# Altium schematic sheet LEO_COTS_ant_tripler_rev1.SchDoc: COTS LEO TX
size A; DocumentNumber: 1; Revision: 1; SheetNumber: 1; SheetTotal: 1
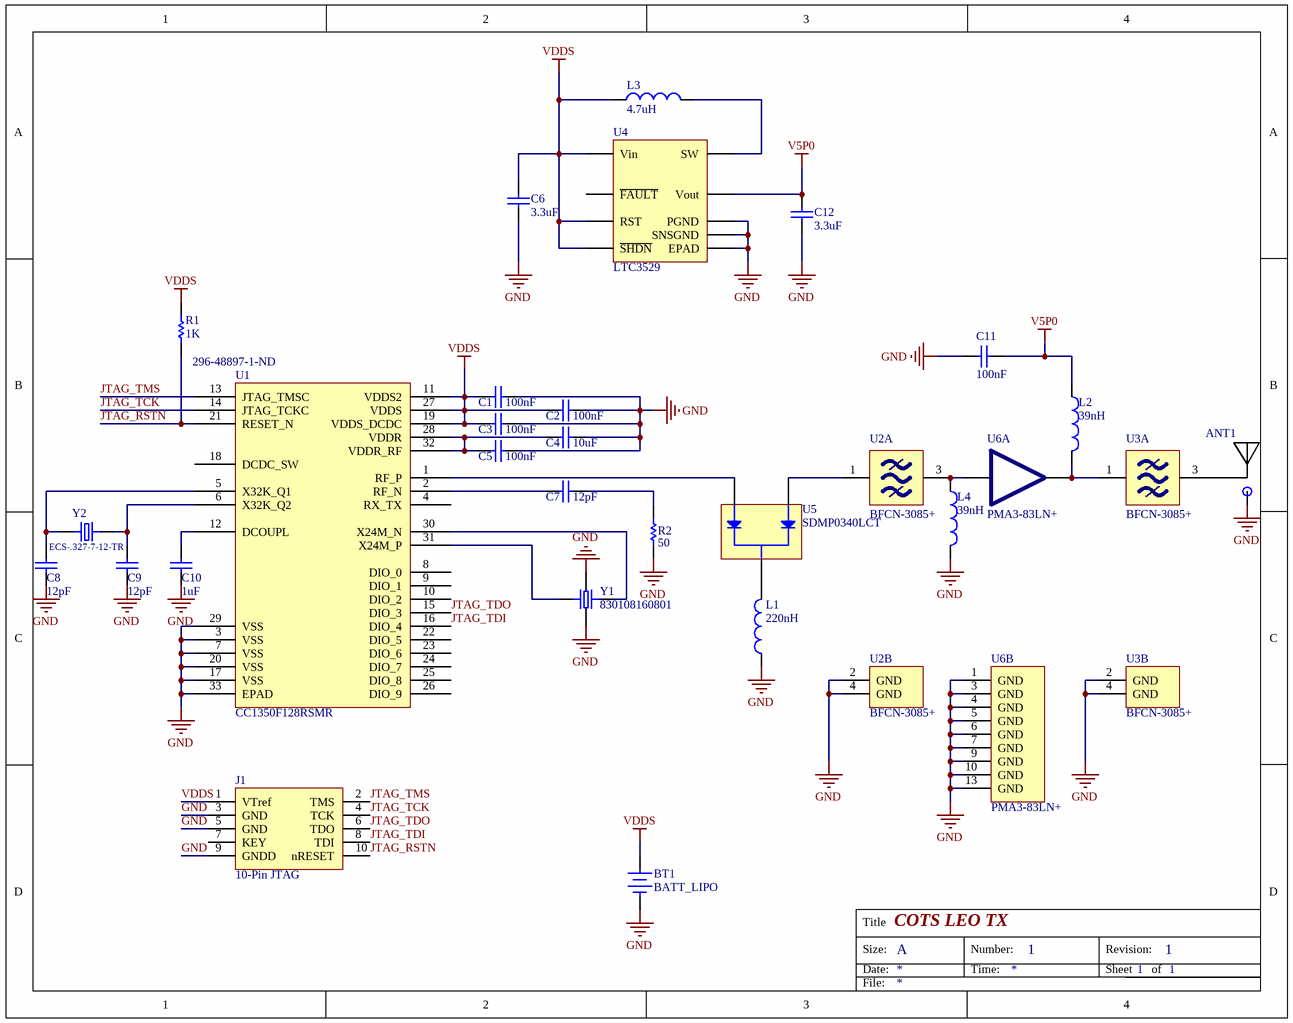
[diagram p0: LEO_COTS_ant_tripler_rev1.SchDoc]

## Parts
ANT1  ANT  [RESLOOP_OD10_fw15_fl180_sw12_sl15]  (value not drawn)  (no BOM)
BT1  BATT_LIPO  [LIPO_1cm_1cm]
C1  value 100nF  [CAPC0603X04N]  (hidden comment: CAP_0201)
C2  value 100nF  [CAPC0603X04N]  (hidden comment: CAP_0201)
C3  value 100nF  [CAPC0603X04N]  (hidden comment: CAP_0201)
C4  value 10uF  [CAPC1608X05N]  (hidden comment: CAP_0603)
C5  value 100nF  [CAPC0603X04N]  (hidden comment: CAP_0201)
C6  value 3.3uF  [CAPC1608X05N]  (hidden comment: CAP_0603)
C7  value 12pF  [CAPC0603X04N]  (hidden comment: CAP_0201)
C8  value 12pF  [CAPC0603X04N]  (hidden comment: CAP_0201)
C9  value 12pF  [CAPC0603X04N]  (hidden comment: CAP_0201)
C10  value 1uF  [CAPC0603X04N]  (hidden comment: CAP_0201)
C11  value 100nF  [CAPC0603X04N]  (hidden comment: CAP_0201)
C12  value 3.3uF  [CAPC1608X05N]  (hidden comment: CAP_0603)
J1  10-Pin JTAG  [FTSH-105-01-F-DV-007-K]
L1  value 220nH  [0402]  (hidden comment: Inductor)
L2  value 39nH  [0402]  (hidden comment: Inductor)
L3  value 4.7uH  [C0805]  (hidden comment: Inductor)
L4  value 39nH  [0402]  (hidden comment: Inductor)
R1  value 1K  [CAPC0603X04N]  (hidden comment: RES_0201)
R2  value 50  [CAPC0603X04N]  (hidden comment: RES_0201)
U1  CC1350F128RSMR  Supplier Part Number 1: 296-48897-1-ND  [QFN40P400X400X100-33N]
U2  BFCN-3085+  [FV1206]  (parts A,B of 2)
U3  BFCN-3085+  [FV1206]  (parts A,B of 2)
U4  LTC3529  [8-DFN]
U5  SDMP0340LCT  [SOT-523]
U6  PMA3-83LN+  [DQ1225]  (parts A,B of 2)
Y1  830108160801  [LFXTAL081608]
Y2  ECS-.327-7-12-TR  [XTAL_ECS-.327-7-12-TR]

## Nets
GND: ANT1.2(-) BT1.2(-) C1.1 C2.1 C3.1 C4.2 C5.1 C6.1 C8.1 C9.1 C10.1 C11.1 C12.1 J1.3(GND) J1.5(GND) J1.9(GNDD) L1.2 L4.2 R2.1 U1.3(VSS) U1.7(VSS) U1.17(VSS) U1.20(VSS) U1.29(VSS) U1.33(EPAD) U2.2(GND) U2.4(GND) U3.2(GND) U3.4(GND) U4.4(PGND) U4.6(SNSGND) U4.9(EPAD) U6.1(GND) U6.3(GND) U6.4(GND) U6.5(GND) U6.6(GND) U6.7(GND) U6.9(GND) U6.10(GND) U6.13(GND) Y1.2 Y1.4
V5P0: C11.2 C12.2 L2.1 U4.1(Vout)
VDDS: BT1.1(+) C1.2 C2.2 C3.2 C6.2 J1.1(VTref) L3.1 R1.2 U1.11(VDDS2) U1.19(VDDS_DCDC) U1.27(VDDS) U4.3(~{SHDN}) U4.7(RST) U4.8(Vin)
JTAG_RSTN: J1.10(nRESET) R1.1 U1.21(RESET_N)
JTAG_TCK: J1.4(TCK) U1.14(JTAG_TCKC)
JTAG_TDI: J1.8(TDI) U1.16(DIO_4)
JTAG_TDO: J1.6(TDO) U1.15(DIO_3)
JTAG_TMS: J1.2(TMS) U1.13(JTAG_TMSC)
NetANT1_1: ANT1.1(+) U3.3(OUT)
NetC4_1: C4.1 C5.2 U1.28(VDDR) U1.32(VDDR_RF)
NetC7_1: C7.1 R2.2
NetC7_2: C7.2 U1.2(RF_N)
NetC8_2: C8.2 U1.5(X32K_Q1) Y2.1
NetC9_2: C9.2 U1.6(X32K_Q2) Y2.2
NetC10_2: C10.2 U1.12(DCOUPL)
NetL1_1: L1.1 U5.3
NetL2_2: L2.2 U3.1(IN) U6.8(OUT)
NetL3_2: L3.2 U4.2(SW)
NetL4_1: L4.1 U2.3(OUT) U6.2(IN)
NetU1_1: U1.1(RF_P) U5.1
NetU1_30: U1.30(X24M_N) Y1.3
NetU1_31: U1.31(X24M_P) Y1.1
NetU2_1: U2.1(IN) U5.2

Not connected (* = marked no-connect by the designer): J1 7(KEY); U1 4(RX_TX) 8(DIO_0) 9(DIO_1) 10(DIO_2) 18(DCDC_SW) 22(DIO_5) 23(DIO_6) 24(DIO_7) 25(DIO_8) 26(DIO_9); U4 5(~{FAULT})

## Notes on the sheet
- Title
- Size:
- Date:
- A
- Number:
- Time:
- Revision:
- Sheet
- of
- File:

## Library data of the parts
ANT1 = ANT: PCB antenna
C1-C3 C5 C11 = CAP_0201: CAP CER 100nF 0201
C4 = CAP_0603: CAP CER 10uF 0603
C6 C12 = CAP_0603: CAP CER 3.3uF 0603; Supplier 1: Digi-Key; Supplier Part Number 1: 445-12446-1-ND
C7-C9 = CAP_0201: CAP CER 12pF 0201
C10 = CAP_0201: CAP CER 1uF 0201
J1 = CM10: Supplier 1: Digi-Key; Supplier Part Number 1: FTSH-105-01-L-DV-007-K-P-ND
L1-L4 = Inductor: Code_IEC: 1005; Published: 8-Jun-2000; LatestRevisionDate: 29-May-2009; LatestRevisionNote: IPC-7351 Footprint Added.; PackageReference: 0402-A; Publisher: Altium Limited; PackageDescription: Chip Inductor; Code_JEITA: 0402
  L1: Supplier 1: Coilcraft; Supplier Part Number 1: 0402FL-221XJR_
  L2 L4: Supplier 1: Digi-Key; Supplier Part Number 1: 490-1153-1-ND
  L3: Supplier 1: Digi-Key; Supplier Part Number 1: 535-12790-1-ND
R1 = Res Semi: RES 1K OHM 0201; Published: 8-Jun-2000; LatestRevisionDate: 17-Jul-2002; LatestRevisionNote: Re-released for DXP Platform.; PackageReference: AXIAL-0.5; Publisher: Altium Limited; PackageDescription: Axial Device, Thru-Hole; 2 Leads; 0.5 in Pin Spacing
R2 = Res Semi: RES 50 OHM 0201; Published: 8-Jun-2000; LatestRevisionDate: 17-Jul-2002; LatestRevisionNote: Re-released for DXP Platform.; PackageReference: AXIAL-0.5; Publisher: Altium Limited; PackageDescription: Axial Device, Thru-Hole; 2 Leads; 0.5 in Pin Spacing
U1 = CC1350F128RSMR: Ultra-Low-Power Dual-Band Wireless MCU; Supplier 1: Digi-Key
U2 U3 = BFCN-3085+: 2800 to 3400 MHz Band-Pass Filter; Supplier 1: Mini-Circuits; Supplier Part Number 1: BFCN-3085+
U4 = LTC3529: 5V Boost Converter
U5 = SDMP0340LCT: Dual Common Cathode Schottky; Supplier 1: Digi-Key; Supplier Part Number 1: SDMP0340LCT-FDICT-ND
U6 = PMA3-83LN+: Wideband LNA; Supplier 1: Mini-Circuits; Supplier Part Number 1: PMA3-83LN+
Y1 = 830108160801: 24 MHz crystal; Package: None; Price: None; Value: *; Availability: Unavailable; Supplier Part Number 1: 1923-830108160801CT-ND; Supplier 1: Digi-Key
Y2 = ECS-.327-7-12-TR: 32.768 kHz SMD Crystal; Package: None; Price: None; Value: *; MP: ECS-.327-7-12-TR; Availability: Unavailable